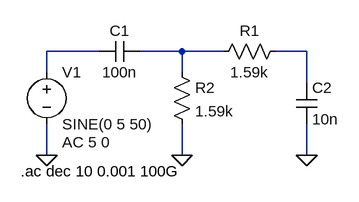
[diagram p0: schematic BPF.asc]
BPF.asc, the LTspice schematic file:
Version 4.1
SHEET 1 880 680
WIRE 192 128 112 128
WIRE 320 128 256 128
WIRE 384 128 320 128
WIRE 512 128 464 128
WIRE 112 160 112 128
WIRE 320 160 320 128
WIRE 512 176 512 128
WIRE 112 288 112 240
WIRE 320 288 320 240
WIRE 512 288 512 240
FLAG 112 288 0
FLAG 320 288 0
FLAG 512 288 0
SYMBOL voltage 112 144 R0
WINDOW 123 24 124 Left 2
WINDOW 39 0 0 Left 0
SYMATTR InstName V1
SYMATTR Value SINE(0 5 50)
SYMATTR Value2 AC 5 0
SYMBOL cap 256 112 R90
WINDOW 0 0 32 VBottom 2
WINDOW 3 32 32 VTop 2
SYMATTR InstName C1
SYMATTR Value 100n
SYMBOL res 480 112 R90
WINDOW 0 0 56 VBottom 2
WINDOW 3 32 56 VTop 2
SYMATTR InstName R1
SYMATTR Value 1.59k
SYMBOL res 304 144 R0
SYMATTR InstName R2
SYMATTR Value 1.59k
SYMBOL cap 496 176 R0
SYMATTR InstName C2
SYMATTR Value 10n
TEXT 72 312 Left 2 !.ac dec 10 0.001 100G

The netlist it stands for:
* BPF.asc
V1 N001 0 SINE(0 5 50) AC 5 0
C1 N002 N001 100n
R1 N003 N002 1.59k
R2 N002 0 1.59k
C2 N003 0 10n
.ac dec 10 0.001 100G
.backanno
.end